# Altium schematic sheet SparkFun_Qwiic_VR_IMU_Breakout.SchDoc.SchDoc
size 270 x 204 mm; Origin: Eagle; GateName_1: G$1; SymbolName_1: FRAME-LETTER; LibraryName: SparkFun-Aesthetics; DeviceSetName: FRAME-LETTER
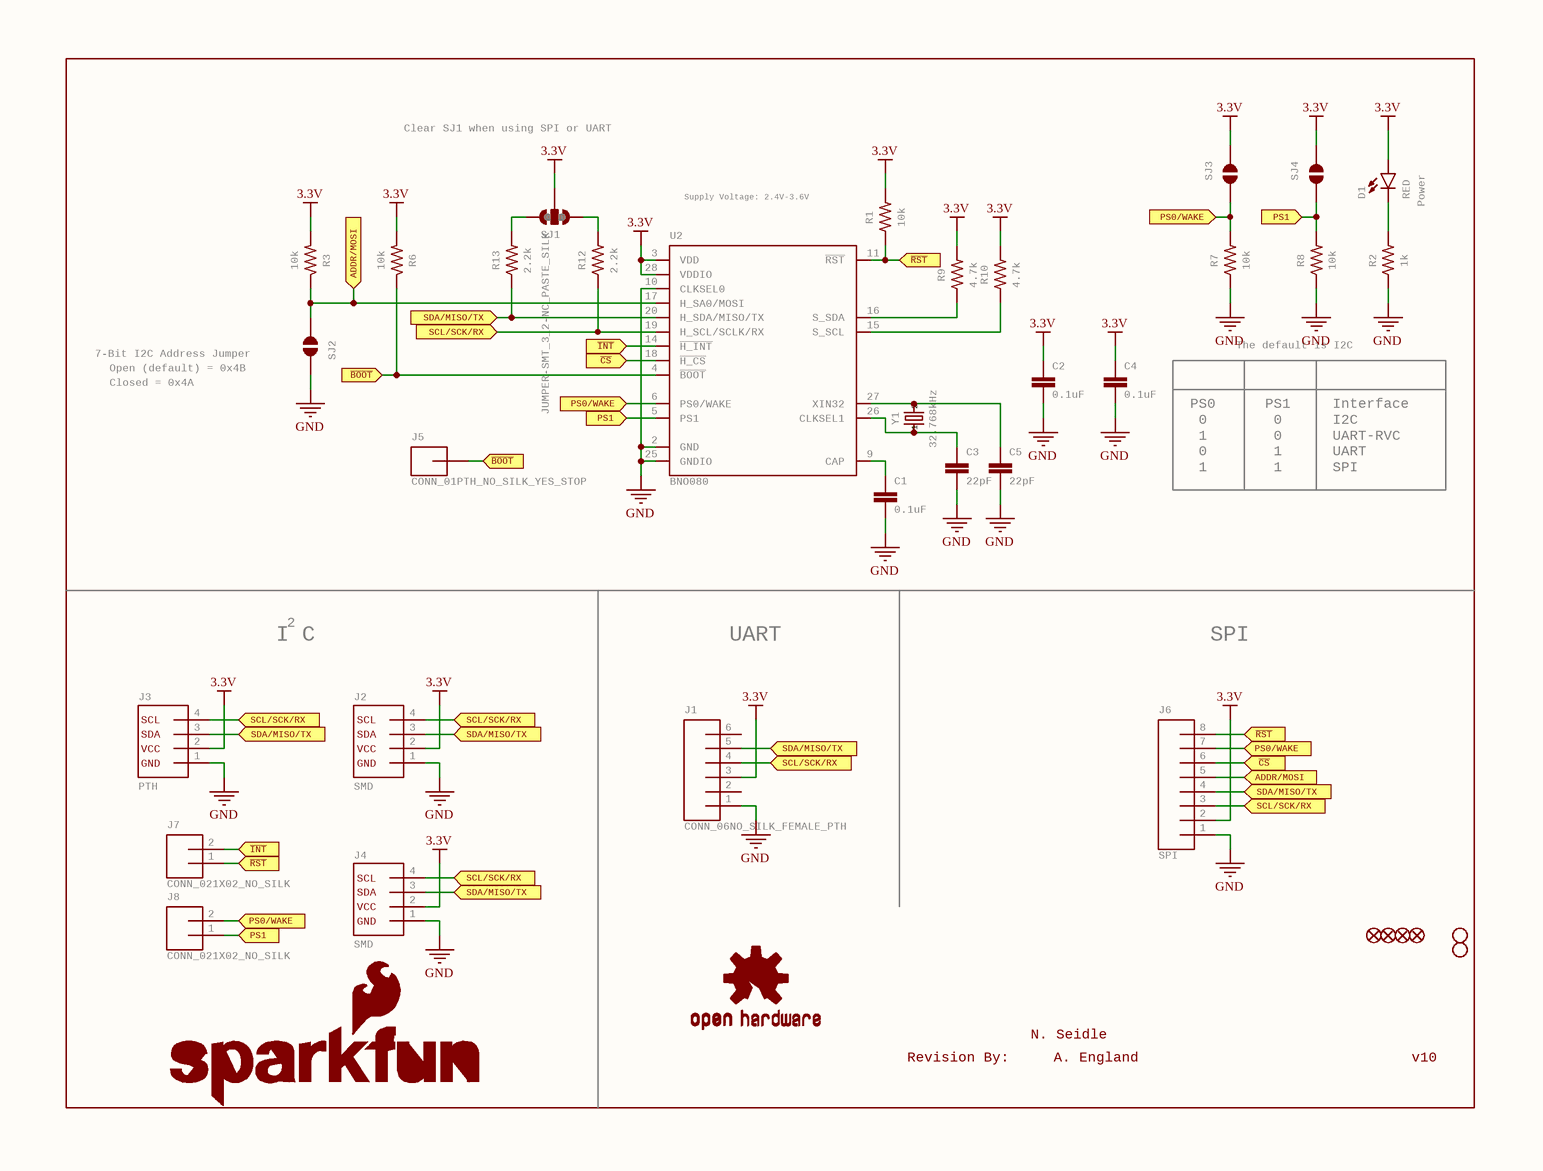
[diagram p0: SparkFun_Qwiic_VR_IMU_Breakout.SchDoc.SchDoc]

## Parts
C1  0.1uF  [0603]
C2  0.1uF  [0603]
C3  22pF  [0603]
C4  0.1uF  [0603]
C5  22pF  [0603]
D1  RED  [LED-0603]
J1  CONN_06NO_SILK_FEMALE_PTH  [1X06_NO_SILK]
J2  SMD  [1X04_1MM_RA]
J3  PTH  [1X04_NO_SILK]
J4  SMD  [1X04_1MM_RA]
J5  CONN_01PTH_NO_SILK_YES_STOP  [1X01_NO_SILK]
J6  SPI  [1X08_NO_SILK]
J7  CONN_021X02_NO_SILK  [1X02_NO_SILK]
J8  CONN_021X02_NO_SILK  [1X02_NO_SILK]
JP1  FIDUCIALUFIDUCIAL  [MICRO-FIDUCIAL]  (value not drawn)
JP2  FIDUCIALUFIDUCIAL  [MICRO-FIDUCIAL]  (value not drawn)
JP3  STAND-OFF  [STAND-OFF]  (value not drawn)
JP4  STAND-OFF  [STAND-OFF]  (value not drawn)
JP5  FIDUCIALUFIDUCIAL  [MICRO-FIDUCIAL]  (value not drawn)
JP6  FIDUCIALUFIDUCIAL  [MICRO-FIDUCIAL]  (value not drawn)
LOGO1  OSHW-LOGOMINI  [OSHW-LOGO-MINI]  (value not drawn)
LOGO2  RevisionBy: Revision By:  [REVISION]  (hidden comment: REVISION)
LOGO4  SFE_LOGO_FLAME.1_INCH  [SFE_LOGO_FLAME_.1]  (value not drawn)
LOGO5  SFE_LOGO_NAME_FLAME.1_INCH  [SFE_LOGO_NAME_FLAME_.1]  (value not drawn)
R1  10k  [0603]
R2  1k  [0603]
R3  10k  [0603]
R6  10k  [0603]
R7  10k  [0603]
R8  10k  [0603]
R9  4.7k  [0603]
R10  4.7k  [0603]
R12  2.2k  [0603]
R13  2.2k  [0603]
SJ1  JUMPER-SMT_3_2-NC_PASTE_SILK  [SMT-JUMPER_3_2-NC_PASTE_SILK]
SJ2  SOLDERJUMPERNO  [SJ_2S-NO]  (value not drawn)
SJ3  SOLDERJUMPERNO  [SJ_2S-NO]  (value not drawn)
SJ4  SOLDERJUMPERNO  [SJ_2S-NO]  (value not drawn)
U2  BNO080  [LGA-28]
Y1  32.768kHz  [CRYSTAL-SMD-3.2X1.5MM]

## Ports
ADDR/MOSI (in), PS0/WAKE (in), PS1 (in), SCL/SCK/RX (in), SDA/MISO/TX (in), ~{BOOT} (in), ~{CS} (in), ~{INT} (in), ~{RST} (in)

## Nets
3.3V: C2.1 C4.1 D1.A J1.3 J2.2(VCC) J3.2(VCC) J4.2(VCC) J6.2 R1.2 R3.2 R6.2 R9.2 R10.2 SJ1.2 SJ3.1 SJ4.1 U2.3(VDD) U2.28(VDDIO)
GND: C1.2 C2.2 C3.2 C4.2 C5.2 J1.1 J2.1(GND) J3.1(GND) J4.1(GND) J6.1 R2.1 R7.1 R8.1 SJ2.1 U2.2(GND) U2.10(CLKSEL0) U2.25(GNDIO)
ADDR/MOSI: J6.5 R3.1 SJ2.2 U2.17(H_SA0/MOSI) ; port ADDR/MOSI
~{BOOT}: J5.1 R6.1 U2.4(~{BOOT}) ; port ~{BOOT}
~{CS}: J6.6 U2.18(~{H_CS}) ; port ~{CS}
~{INT}: J7.2 U2.14(~{H_INT}) ; port ~{INT}
PS0/WAKE: J6.7 J8.2 R7.2 SJ3.2 U2.6(PS0/WAKE) ; port PS0/WAKE
PS1: J8.1 R8.2 SJ4.2 U2.5(PS1) ; port PS1
~{RST}: J6.8 J7.1 R1.1 U2.11(~{RST}) ; port ~{RST}
SCL/SCK/RX: J1.4 J2.4(SCL) J3.4(SCL) J4.4(SCL) J6.3 R12.1 U2.19(H_SCL/SCLK/RX) ; port SCL/SCK/RX
SDA/MISO/TX: J1.5 J2.3(SDA) J3.3(SDA) J4.3(SDA) J6.4 R13.1 U2.20(H_SDA/MISO/TX) ; port SDA/MISO/TX
NetC1_1: C1.1 U2.9(CAP)
NetC3_1: C3.1 U2.26(CLKSEL1) Y1.P$1
NetC5_1: C5.1 U2.27(XIN32) Y1.P$2
NetD1_C: D1.C R2.2
NetR9_1: R9.1 U2.16(S_SDA)
NetR10_1: R10.1 U2.15(S_SCL)
NetR12_2: R12.2 SJ1.1
NetR13_2: R13.2 SJ1.3

Not connected (* = marked no-connect by the designer): J1 2 6

## Notes on the sheet
- Clear SJ1 when using SPI or UART
- Supply Voltage: 2.4V-3.6V
- (near D1) Power
- 7-Bit I2C Address Jumper
- Closed = 0x4A
- Open (default) = 0x4B
- The default is I2C
- PS0
  0
  1
  0
  1
- PS1
  0
  0
  1
  1
- Interface
  I2C
  UART-RVC
  UART
  SPI
- 2
- I C
- UART
- SPI
- N. Seidle
- A. England
- v10

## Library data of the parts
C1 C2 C4 = 0.1UF-0603-25V-(+80/-20%): 0.1ÂµF ceramic capacitors    A capacitor is a passive two-terminal electrical component used to store electrical energy temporarily in an electric field.; GateName_1: G$1; SymbolName_1: CAP; PROD_ID: CAP-00810; DeviceName: -0603-25V-(+80/-20%); LibraryName: SparkFun-Capacitors; DeviceSetName: 0.1UF
C3 C5 = 22PF-0603-50V-5%: 22pF ceramic capacitors    A capacitor is a passive two-terminal electrical component used to store electrical energy temporarily in an electric field.; GateName_1: G$1; SymbolName_1: CAP; PROD_ID: CAP-07876; DeviceName: -0603-50V-5%; LibraryName: SparkFun-Capacitors; DeviceSetName: 22PF
D1 = LED-RED0603: Red SMD LED    Used in manufacturing of most products at SparkFun   Packages: 0603 - SMD 0603 package [Product Link]  0603 SMART - SMD 0603 SMART package ( more efficient and expensive)[Product Link]   1206 - SMD1206  package [Product Link]    SparkFun Products: Pro Mini 328 -5V  RedBoard  IOIO-OTG; GateName_1: G$1; DeviceName: 0603; PROD_ID: DIO-00819; SymbolName_1: LED; LibraryName: SparkFun-LED; DeviceSetName: LED-RED
J1 = CONN_06NO_SILK_FEMALE_PTH: Multi connection point. Often used as Generic Header-pin footprint for 0.1 inch spaced/style header connections    On any of the 0.1 inch spaced packages, you can populate with these:  Break Away Headers - Straight (PRT-00116)   Break Away Male Headers - Right Angle (PRT-00553)   Female Headers (PRT-00115)   Break Away Headers - Machine Pin (PRT-00117)   Break Away Female Headers - Swiss Machine Pin (PRT-00743)   Arduino Stackable Header - 6 Pin (PRT-09280)        For SCREWTERMINALS and SPRING TERMINALS visit here:  Screw Terimnals on SparkFun.com (5mm/3.5mm/2.54mm spacing)       This device is also useful as a general connection point to wire up your design to another part of your project. Our various solder wires solder well into these plated through hole pads.  Hook-Up Wire - Assortment (Stranded, 22 AWG) (PRT-11375)   Hook-Up Wire - Assortment (Solid Core, 22 AWG) (PRT-11367)   View the entire wire category on our website here; GateName_1: G$1; PROD_ID: CONN-08437; SymbolName_1: CONN_06; DeviceName: NO_SILK_FEMALE_PTH; LibraryName: SparkFun-Connectors; DeviceSetName: CONN_06
J2 J4 = I2C_STANDARDJS-1MM: SparkFun I2C Standard Pinout Header    SparkFun has standardized on a pinout for all I2C based sensor breakouts.  This pinout allows I2C boards to be plugged directly into the headers on Arduino Uno compatible boards, and to be daisy chained easily.   Example SparkFun Products: SparkFun Atmospheric Sensor Breakout - BME280  SparkFun Altitude/Pressure Sensor Breakout - MPL3115A2  SparkFun TOF Range Finder Sensor - VL6180; GateName_1: G$1; DeviceName: JS-1MM; SymbolName_1: I2C_STANDARD; LibraryName: SparkX; DeviceSetName: I2C_STANDARD; SDA: SDA; VCC: VCC; GND: GND; SCL: SCL
J3 = I2C_STANDARD_NO_SILK: SparkFun I2C Standard Pinout Header    SparkFun has standardized on a pinout for all I2C based sensor breakouts.  This pinout allows I2C boards to be plugged directly into the headers on Arduino Uno compatible boards, and to be daisy chained easily.   Example SparkFun Products: SparkFun Atmospheric Sensor Breakout - BME280  SparkFun Altitude/Pressure Sensor Breakout - MPL3115A2  SparkFun TOF Range Finder Sensor - VL6180; GateName_1: G$1; SymbolName_1: I2C_STANDARD; DeviceName: _NO_SILK; LibraryName: SparkX; DeviceSetName: I2C_STANDARD; SDA: SDA; VCC: VCC; GND: GND; SCL: SCL
J5 = CONN_01PTH_NO_SILK_YES_STOP: Single connection point. Often used as Generic Header-pin footprint for 0.1 inch spaced/style header connections       On any of the 0.1 inch spaced packages, you can populate with these:   Break Away Headers - Straight (PRT-00116)   Break Away Male Headers - Right Angle (PRT-00553)   Female Headers (PRT-00115)   Break Away Headers - Machine Pin (PRT-00117)   Break Away Female Headers - Swiss Machine Pin (PRT-00743)          This device is also useful as a general connection point to wire up your design to another part of your project. Our various solder wires solder well into these plated through hole pads.   Hook-Up Wire - Assortment (Stranded, 22 AWG) (PRT-11375)   Hook-Up Wire - Assortment (Solid Core, 22 AWG) (PRT-11367)   View the entire wire category on our website here          Special notes:    SMTSO-256-ET is a "flush mount" nut for a 4-40 screw. We mostly use this on specialty testbeds; it is a nice way to connect hardware to your PCB at an adjustable hieght.    Also note, the SNAP packages are for using a snappable style connector. We sell a baggie of snaps and they are also used on two LilyPad designs:   Snap Assortment - 30 pack (male and female) (DEV-11347)  LilyPad Arduino SimpleSnap (DEV-10941)   LilyPad SimpleSnap Protoboard (DEV-10940); GateName_1: G$1; SymbolName_1: CONN_01; DeviceName: PTH_NO_SILK_YES_STOP; LibraryName: SparkFun-Connectors; DeviceSetName: CONN_01
J6 = CONN_08NO_SILK_FEMALE_PTH: Multi connection point. Often used as Generic Header-pin footprint for 0.1 inch spaced/style header connections    On any of the 0.1 inch spaced packages, you can populate with these:  Break Away Headers - Straight (PRT-00116)   Break Away Male Headers - Right Angle (PRT-00553)   Female Headers (PRT-00115)   Break Away Headers - Machine Pin (PRT-00117)   Break Away Female Headers - Swiss Machine Pin (PRT-00743)   Arduino Stackable Header - 8 Pin (PRT-09279)        For SCREWTERMINALS and SPRING TERMINALS visit here:  Screw Terimnals on SparkFun.com (5mm/3.5mm/2.54mm spacing)       This device is also useful as a general connection point to wire up your design to another part of your project. Our various solder wires solder well into these plated through hole pads.  Hook-Up Wire - Assortment (Stranded, 22 AWG) (PRT-11375)   Hook-Up Wire - Assortment (Solid Core, 22 AWG) (PRT-11367)   View the entire wire category on our website here          Special notes:     Molex polarized connector foot print use with SKU : PRT-08231 with associated crimp pins and housings. 1MM SMD Version SKU: PRT-10208    NOTES ON THE VARIANTS LOCK and LOCK_LONGPADS... This footprint was designed to help hold the alignment of a through-hole component (i.e.  6-pin header) while soldering it into place. You may notice that each hole has been shifted either up or down by 0.005 of an inch from it's more standard position (which is a perfectly straight line).  This slight alteration caused the pins (the squares in the middle) to touch the edges of the holes.  Because they are alternating, it causes a "brace" to hold the component in place.  0.005 has proven to be the perfect amount of "off-center" position when using our standard breakaway headers. Although looks a little odd when you look at the bare footprint, once you have a header in there, the alteration is very hard to notice.  Also,if you push a header all the way into place, it is covered up entirely on the bottom side.; GateName_1: G$1; PROD_ID: CONN-08438; SymbolName_1: CONN_08; DeviceName: NO_SILK_FEMALE_PTH; LibraryName: SparkFun-Connectors; DeviceSetName: CONN_08
J7 J8 = CONN_021X02_NO_SILK: Multi connection point. Often used as Generic Header-pin footprint for 0.1 inch spaced/style header connections    On any of the 0.1 inch spaced packages, you can populate with these:  Break Away Headers - Straight (PRT-00116)   Break Away Male Headers - Right Angle (PRT-00553)   Female Headers (PRT-00115)   Break Away Headers - Machine Pin (PRT-00117)   Break Away Female Headers - Swiss Machine Pin (PRT-00743)        For SCREWTERMINALS and SPRING TERMINALS visit here:  Screw Terimnals on SparkFun.com (5mm/3.5mm/2.54mm spacing)       This device is also useful as a general connection point to wire up your design to another part of your project. Our various solder wires solder well into these plated through hole pads.  Hook-Up Wire - Assortment (Stranded, 22 AWG) (PRT-11375)   Hook-Up Wire - Assortment (Solid Core, 22 AWG) (PRT-11367)   View the entire wire category on our website here          Special notes: Molex polarized connector foot print use with: PRT-08233 with associated crimp pins and housings.  2.54_SCREWTERM for use with  PRT-10571.  3.5mm Screw Terminal footprints for  PRT-08084  5mm Screw Terminal footprints for use with PRT-08432; GateName_1: G$1; SymbolName_1: CONN_02; DeviceName: 1X02_NO_SILK; LibraryName: SparkFun-Connectors; DeviceSetName: CONN_02
JP1 JP2 JP5 JP6 = FIDUCIALUFIDUCIAL: Fiducial Alignment PointsVarious fiducial points for machine vision alignment.; GateName_1: G$1; SymbolName_1: FIDUCIAL; DeviceName: UFIDUCIAL; LibraryName: SparkFun; DeviceSetName: FIDUCIAL
JP3 JP4 = STAND-OFF: Stand Off   This is the mechanical footprint for a #4 phillips button head screw. Use the keepout ring to avoid running the screw head into surrounding components. SKU : PRT-00447; GateName_1: G$1; SymbolName_1: STAND-OFF; LibraryName: SparkFun; DeviceSetName: STAND-OFF
LOGO1 = OSHW-LOGOMINI: Open-Source Hardware (OSHW) Logo     This logo indicates the piece of hardware it is found on incorporates a OSHW license and/or adheres to the definition of open source hardware found here: http://freedomdefined.org/OSHW; GateName_1: G$1; DeviceName: MINI; SymbolName_1: OSHW-LOGO; LibraryName: SparkFun-Aesthetics; DeviceSetName: OSHW-LOGO
LOGO2 = REVISION: "Revision By" Text    Preceding text for revisor documentation. Includes schematic text on "symbols" layer, and board text on tDoc.; GateName_1: G$1; SymbolName_1: REVISION; LibraryName: SparkFun-Aesthetics; DeviceSetName: REVISION
LOGO4 = SFE_LOGO_FLAME.1_INCH: SparkFun Flame Logo    This is the SparkFun flame logo. The logo on the schematic will always be the same size; the package variant is the height of the flame. Default layer for the logo on the board is tSilk.; GateName_1: G$1; SymbolName_1: SFE_LOGO_FLAME; DeviceName: .1_INCH; LibraryName: SparkFun-Aesthetics; DeviceSetName: SFE_LOGO_FLAME
LOGO5 = SFE_LOGO_NAME_FLAME.1_INCH: SparkFun Font Logo w/ Flame    This is the SparkFun full logo. The logo on the schematic will always be the same size; the package variant is the height of the flame part of the logo. Default layer for the logo on the board is tSilk.; GateName_1: G$1; SymbolName_1: SFE_LOGO_NAME_FLAME; DeviceName: .1_INCH; LibraryName: SparkFun-Aesthetics; DeviceSetName: SFE_LOGO_NAME_FLAME
R1 R3 R6-R8 = 10KOHM-0603-1/10W-1%: 10kÎ© resistor    A resistor is a passive two-terminal electrical component that implements electrical resistance as a circuit element. Resistors act to reduce current flow, and, at the same time, act to lower voltage levels within circuits. - Wikipedia; GateName_1: G$1; DeviceSetName: 10KOHM; PROD_ID: RES-00824; SymbolName_1: RESISTOR; DeviceName: -0603-1/10W-1%; LibraryName: SparkFun-Resistors
R2 = 1KOHM-0603-1/10W-1%: 1kÎ© resistor    A resistor is a passive two-terminal electrical component that implements electrical resistance as a circuit element. Resistors act to reduce current flow, and, at the same time, act to lower voltage levels within circuits. - Wikipedia; GateName_1: G$1; DeviceSetName: 1KOHM; PROD_ID: RES-07856; SymbolName_1: RESISTOR; DeviceName: -0603-1/10W-1%; LibraryName: SparkFun-Resistors
R9 R10 = 4.7KOHM-0603-1/10W-1%: 4.7kÎ© resistor    A resistor is a passive two-terminal electrical component that implements electrical resistance as a circuit element. Resistors act to reduce current flow, and, at the same time, act to lower voltage levels within circuits. - Wikipedia; GateName_1: G$1; PROD_ID: RES-07857; SymbolName_1: RESISTOR; DeviceName: -0603-1/10W-1%; LibraryName: SparkFun-Resistors; DeviceSetName: 4.7KOHM
R12 R13 = 2.2KOHM-0603-1/10W-1%: 2.2kÎ© resistor    A resistor is a passive two-terminal electrical component that implements electrical resistance as a circuit element. Resistors act to reduce current flow, and, at the same time, act to lower voltage levels within circuits. - Wikipedia; GateName_1: G$1; PROD_ID: RES-08272; SymbolName_1: RESISTOR; DeviceName: -0603-1/10W-1%; LibraryName: SparkFun-Resistors; DeviceSetName: 2.2KOHM
SJ1 = JUMPER-SMT_3_2-NC_PASTE_SILK: Normally closed solder jumper (2 of 2 connections)    This jumper has an aperture in the stencil to allow solder paste to bridge both connections. Both connections are normally closed (NC). Wick off the solder to open the connection(s). Reapply solder to reclose the connection(s).; GateName_1: G$1; SymbolName_1: SMT-JUMPER_3_2-NC_PASTE; DeviceName: _SILK; LibraryName: SparkFun-Jumpers; DeviceSetName: JUMPER-SMT_3_2-NC_PASTE
SJ2-SJ4 = SOLDERJUMPERNO: Solder JumperStandard SMD solder jumper. Used to automate production. Two varients : Normally Open and Normally Closed are the same, but have different paste layers. NC will have a large amount of paste and should jumper during reflow.; GateName_1: 1; SymbolName_1: SJ; DeviceName: NO; LibraryName: SparkFun; DeviceSetName: SOLDERJUMPER
U2 = BNO080: Hillcrest Labs BNO080 - High Precision IMU (VR)    The VR IMU uses the impressive BNO080 IMU. This IC has a combination triple axis accelerometer/gyro/magnetometer packaged with an ARM Cortex M0+ running powerful algorithms. The BNO080 Inertial Measurement Unit (IMU) produces accurate rotation vector headings, excellently suited for VR and other heading applications with a static rotation error of 2 degrees or less. Itâ€™s what weâ€™ve been waiting for: all the sensor data is combined and drift corrected into meaningful, accurate IMU information.   SparkFun Products: VR IMU (BNO080); GateName_1: U1; SymbolName_1: BNO080-IMU; PROD_ID: SEN-13947; LibraryName: SparkFun-IC-Special-Function; DeviceSetName: BNO080
Y1 = CRYSTAL-32.768KHZSMD-3.2X1.5: 32.768kHz Crystal  Frequency: 32.768kHz  Frequency Stability: &plusmn;20ppm  Load Capacitance: 12.5pF (PTH-2X6 & SMD-3.2X1.5), 6pF (SMD-2X6)       SparkFun Products: SparkFun BigTime Watch Kit  SparkFun nRF52832 Breakout  SparkFun Real Time Clock Module; GateName_1: G$1; PROD_ID: XTAL-13062; SymbolName_1: CRYSTAL; DeviceName: SMD-3.2X1.5; LibraryName: SparkFun-Clocks; DeviceSetName: CRYSTAL-32.768KHZ; 1: 1; 2: 2